# EAGLE design isolatedPowerSerial (EAGLE 6.4)
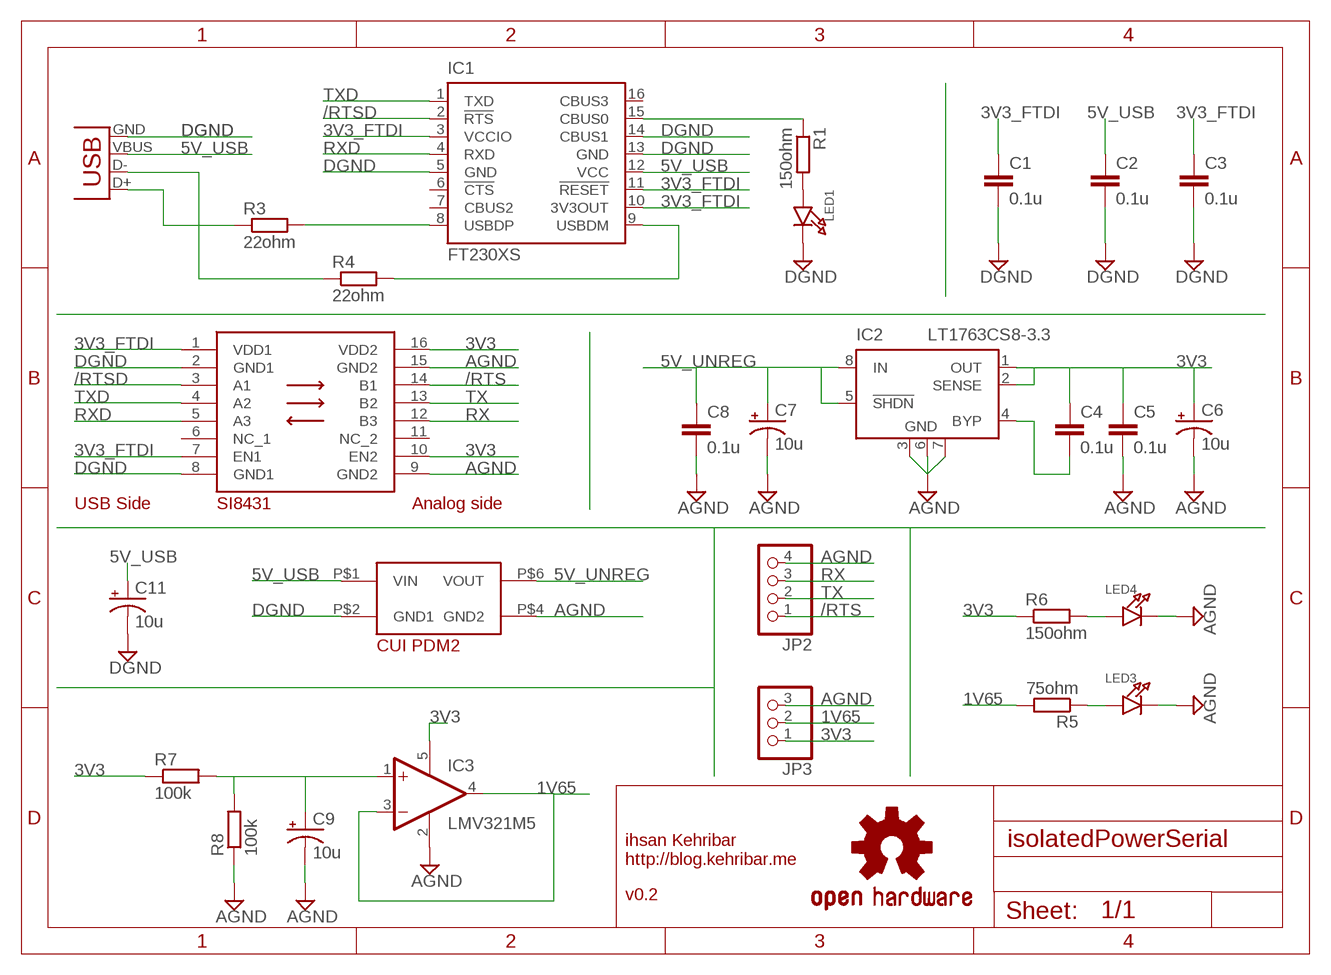
[diagram p0: schematic, sheet 1]

## Parts
C1  0.1u  C-EUC0805  [C0805]
C2  0.1u  C-EUC0805  [C0805]
C3  0.1u  C-EUC0805  [C0805]
C4  0.1u  C-EUC0805  [C0805]
C5  0.1u  C-EUC0805  [C0805]
C6  10u  CPOL-USB/3528-21R  [B/3528-21R]
C7  10u  CPOL-USB/3528-21R  [B/3528-21R]
C8  0.1u  C-EUC0805  [C0805]
C9  10u  CPOL-USB/3528-21R  [B/3528-21R]
C11  10u  CPOL-USB/3528-21R  [B/3528-21R]
IC1  FT230XS  [SSOP16]
IC2  LT1763CS8-3.3  [SOIC8]
IC3  LMV321M5  [SOT23-5]
JP1  USBSMD  [USB-MINIB]
JP2  HEADER-1X4ROUND  [1X04_ROUND]
JP3  HEADER-1X3ROUND  [1X03_ROUND]
LED1  LED0805  [CHIPLED_0805]
LED3  LED0805  [CHIPLED_0805]
LED4  LED0805  [CHIPLED_0805]
LOGO1  OSHW-LOGOS  [OSHW-LOGO-S]
R1  150ohm  R-EU_R0805  [R0805]
R3  22ohm  R-EU_R0805  [R0805]
R4  22ohm  R-EU_R0805  [R0805]
R5  75ohm  R-EU_R0805  [R0805]
R6  150ohm  R-EU_R0805  [R0805]
R7  100k  R-EU_R0805  [R0805]
R8  100k  R-EU_R0805  [R0805]
U$1  IHSAN_SI8431  [SO16L]
U$2  IHSAN_CUI_PDM2  [SIL7]

## Nets
1V65: IC3.3(-IN) IC3.4(OUT) JP3.2 R5.2
3V3: C4.1 C5.1 C6.+ IC2.1(OUT) IC2.2(SENSE) IC3.5(V+) JP3.1 R6.1 R7.1 U$1.10(EN2) U$1.16(VDD2)
3V3_FTDI: C1.1 C3.1 IC1.3(VCCIO) IC1.10(3V3OUT) IC1.11(!RESET) U$1.1(VDD1) U$1.7(EN1)
5V_UNREG: C7.+ C8.1 IC2.5(!SHDN) IC2.8(IN) U$2.P$6(VOUT)
5V_USB: C2.1 C11.+ IC1.12(VCC) JP1.VBUS U$2.P$1(VIN)
/RTS: JP2.1 U$1.14(B1)
/RTSD: IC1.2(!RTS) U$1.3(A1)
AGND: C5.2 C6.- C7.- C8.2 C9.- IC2.3(GND) IC2.6(GND) IC2.7(GND) IC3.2(V-) JP2.4 JP3.3 LED3.C LED4.C R8.1 U$1.9(GND2) U$1.15(GND2) U$2.P$4(GND2)
DGND: C1.2 C2.2 C3.2 C11.- IC1.5(GND) IC1.13(GND) IC1.14(CBUS1) JP1.GND LED1.C U$1.2(GND1) U$1.8(GND1) U$2.P$2(GND1)
N$1: IC1.15(CBUS0) R1.1
N$4: IC1.8(USBDP) R3.2
N$5: JP1.D+ R3.1
N$6: JP1.D- R4.1
N$7: IC1.9(USBDM) R4.2
N$8: C4.2 IC2.4(BYP)
N$9: LED3.A R5.1
N$10: LED4.A R6.2
N$12: LED1.A R1.2
N$14: C9.+ IC3.1(+IN) R7.2 R8.2
RX: JP2.3 U$1.12(B3)
RXD: IC1.4(RXD) U$1.5(A3)
TX: JP2.2 U$1.13(B2)
TXD: IC1.1(TXD) U$1.4(A2)
Unconnected: IC1.6(!CTS) IC1.7(CBUS2) IC1.16(CBUS3) U$1.6(NC_1) U$1.11(NC_2)

## Notes on the sheet
- USB Side | Analog side
- ihsan Kehribar
  http://blog.kehribar.me
- v0.2

## Library data of the parts
C1-C5 C8 = rcl:C-EU: CAPACITOR, European symbol
C6 C7 C9 C11 = rcl:CPOL-US: POLARIZED CAPACITOR, American symbol
IC1 = ftdichip:FT230X: USB to BASIC UART IC Auto generated by make-symbol-device-package-bsdl.ulp Rev. 43 Source: Data sheet <http://www.ftdichip.com/Support/Documents/DataSheets/ICs/DS_FT230X.pdf>
IC2 = linear-technology:LT1763CS8: 500mA, Low Noise, LDO Micropower Regulators Source: http://cds.linear.com/docs/Datasheet/1763ff.pdf; MPN: LT1763CS8-3.3; OC_FARNELL: 1273617; OC_NEWARK: 57M6055
IC3 = linear:LMV321?*: General Purpose, Low Voltage, Rail-to-Rail Output Operational Amplifiers Source: http://www.national.com/mpf/LM/LMV321.html http://www.national.com/dt/lmv_qual.pdf
JP1 = SparkFun-Connectors:USB: USB Connectors USB-B-PTH is fully proven SKU : PRT-00139/CONN-08278 USB-miniB is fully proven SKU : PRT-00587 USB-A-PCB is untested. USB-A-H is throughly reviewed, but untested. Spark Fun Electronics SKU : PRT-00437 USB-B-SMT is throughly reviewed, but untested. Needs silkscreen touching up. USB-A-S has not been used/tested USB-MB-H has not been used/tested USB-MICROB has been used. CONN-09505
JP2 = microbuilder:HEADER-1X4: PIN HEADER
JP3 = microbuilder:HEADER-1X3: PIN HEADER
LED1 LED3 LED4 = microbuilder:LED: LED 0603 - 0603 Surface Mount Package 2mA: Green LED - Low Power (3.9mcd, 2ma, 1.7Vf) - Digikey: 475-2709-2-ND Orange LED - Low Power (9.8mcd, 2ma, 1.8Vf) - Digikey: 475-1194-2-ND Red LED - Low Power (5mcd, 2ma, 1.8Vf) - Digikey: 475-1195-2-ND Yellow LED - Low Power (7mcd, 2ma, 1.8Vf) - Digikey: 475-1196-2-ND 5mA: Blue LED - Low Power (17mcd, 5ma, 2.9Vf) - Digikey: LNJ937W8CRACT-ND 0805 - 0805 Surface Mount Package 2mA: Red LED (8.8mcd, 2mA, 1.8Vf, Clear) - Low Power [Digikey: 475-2510-1-ND] Green LED (5mcd, 2mA, 1.8Vf, Clear) - Low Power [Digikey: 475-2730-1-ND] Yellow LED (11.3mcd, 2mA, 1.8Vf, Clear) - Low Power [Digikey: 475-2555-1-ND] 20mA: Red LED (104mcd, 20mA, Diffused) - LS R976 [Digikey: 475-1278-6-ND] Red LED (12mcd, 20mA, 2.0Vf, Clear) - APT2012EC [Digikey: 754-1128-1-ND] Green LED (15mcd, 20mA, 2.2Vf, Clear) - APT2012GC [Digikey: 754-1131-1-ND] Orange LED (160mcd, 20mA, 2.1Vf, Clear) - APT2012SECK [Digikey: 754-1130-1-ND] 1206 - 1206 Surface Mount Package Green LED (26mcd, 20mA, Diffused) - LG N971 [Digikey: 475-1407-6-ND] Red LED (15mcd, 20mA, Diffused) - LH N974 [Digikey: 475-1416-6-ND]
LOGO1 = SparkFun-Aesthetics:OSHW-LOGO: Open Source Hardware Logo This logo indicates the piece of hardware it is found on incorporates a OSHW license and/or adheres to the definition of open source hardware found here: http://freedomdefined.org/OSHW
R1 R3-R8 = rcl:R-EU_: RESISTOR, European symbol
U$1 = SparkFun-DigitalIC:IHSAN_SI8431
U$2 = SparkFun-DigitalIC:IHSAN_CUI_PDM2

## Board
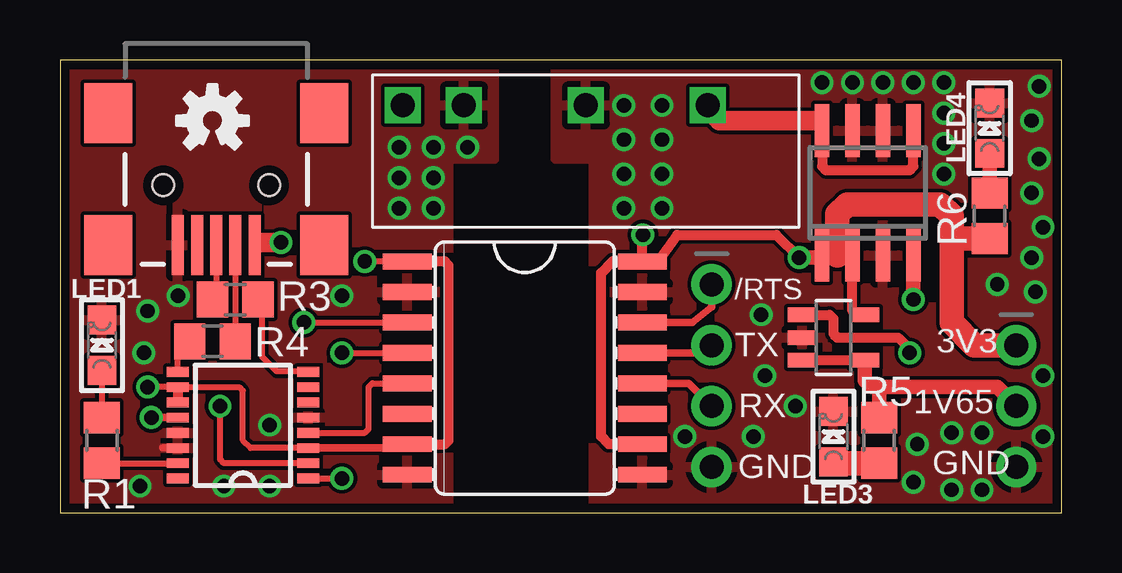
[diagram p1: board, top side]
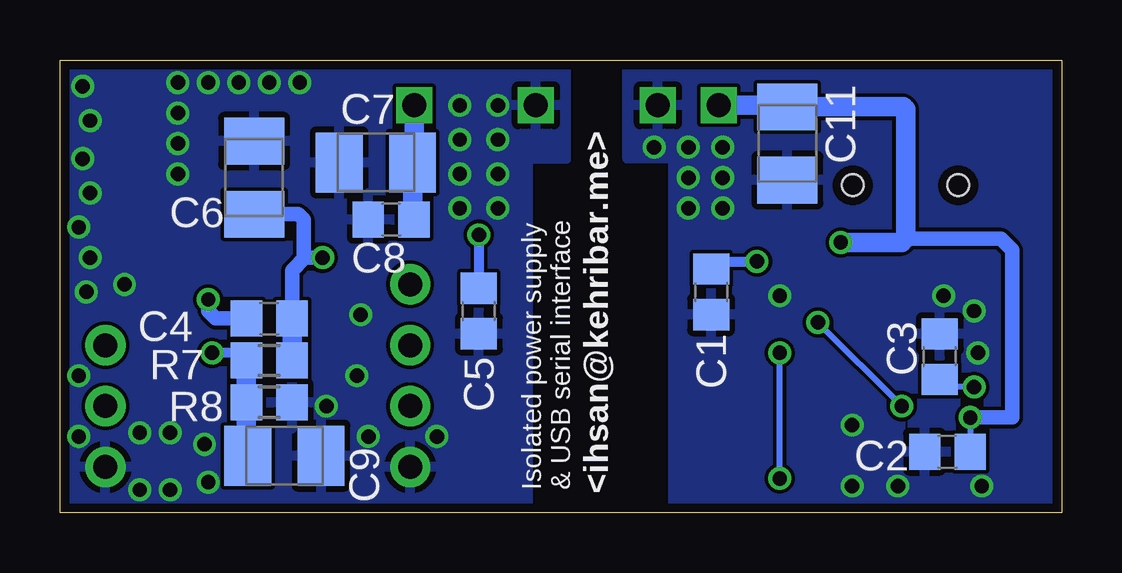
[diagram p2: board, bottom side, seen from below]

Size 41.74 x 18.88 mm. Coordinates in mm from the lower left corner, seen from the top.
Outline: 0,0 41.74,0 41.74,18.88 0,18.88 0,0
Copper layers (1*16): Top 0.0356mm / dielectric 1.5011mm / Bottom 0.0356mm
Design rules "LaenPCBOrder": minimum track width 6mil, minimum drill 13mil, track to track 6mil, track to pad 6mil, pad to pad 6mil, via to via 6mil, smd to smd 6mil, copper to edge 15mil, drill to drill 6mil, minimum pad ring 7mil, minimum via ring 7mil, stop-mask expansion 4mil, vias tented up to drill 0mil, thermal gap 10mil

### Footprints (pad centres in the part's own frame; a part is rotated, then mirrored left to right if it is on the bottom)
C0805 = smd 1.3 x 1.5: 1 -0.95,0; 2 0.95,0
B/3528-21R = smd 1.95 x 2.5: + 1.525,0; - -1.525,0
SSOP16 = smd 0.914 x 0.406: 1 -2.718,2.223; 2 -2.718,1.587; 3 -2.718,0.953; 4 -2.718,0.318; 5 -2.718,-0.318; 6 -2.718,-0.953; 7 -2.718,-1.587; 8 -2.718,-2.223; 9 2.718,-2.223; 10 2.718,-1.587; 11 2.718,-0.953; 12 2.718,-0.318; 13 2.718,0.318; 14 2.718,0.953; 15 2.718,1.587; 16 2.718,2.223
SOIC8 = smd 0.6 x 2.2: 1 -1.905,-2.6; 2 -0.635,-2.6; 3 0.635,-2.6; 4 1.905,-2.6; 5 1.905,2.6; 6 0.635,2.6; 7 -0.635,2.6; 8 -1.905,2.6
SOT23-5 = smd 0.6 x 1.2: 1 -0.95,-1.306; 2 0,-1.306; 3 0.95,-1.306; 4 0.95,1.306; 5 -0.95,1.306
USB-MINIB = smd 2.5 x 0.5: D+ 2.5,0; D- 2.5,0.8; GND 2.5,-1.6; ID 2.5,-0.8; VBUS 2.5,1.6 | smd 2.5 x 2: MTN1 -3,4.5; MTN2 2.5,4.5; MTN3 -3,-4.5; MTN4 2.5,-4.5 | hole 0.9: 0,2.2; 0,-2.2
1X04_ROUND = drill 1 pad 1.676: 1 -3.81,0; 2 -1.27,0; 3 1.27,0; 4 3.81,0
1X03_ROUND = drill 1 pad 1.676: 1 -2.54,0; 2 0,0; 3 2.54,0
CHIPLED_0805 = smd 1.2 x 1.2: A 0,-1.05; C 0,1.05
R0805 = smd 1.3 x 1.5: 1 -0.95,0; 2 0.95,0
SO16L = smd 0.66 x 2.032: 1 -4.445,-4.902; 2 -3.175,-4.902; 3 -1.905,-4.902; 4 -0.635,-4.902; 5 0.635,-4.902; 6 1.905,-4.902; 7 3.175,-4.902; 8 4.445,-4.902; 9 4.445,4.902; 10 3.175,4.902; 11 1.905,4.902; 12 0.635,4.902; 13 -0.635,4.902; 14 -1.905,4.902; 15 -3.175,4.902; 16 -4.445,4.902
SIL7 = drill 1 square: P$1 -7.62,0; P$2 -5.08,0; P$4 0,0; P$6 5.08,0

### Placement (x,y rotation side)
C1  14.61,9.21 270 bottom
C2  4.76,2.54 180 bottom
C3  5.08,6.51 90 bottom
C4  33.02,8.1 180 bottom
C5  24.29,8.41 270 bottom
C6  33.66,13.97 270 bottom
C7  28.57,14.61 0 bottom
C8  27.94,12.22 180 bottom
C9  32.38,2.38 180 bottom
C11  11.43,15.4 90 bottom
IC1  7.62,3.65 180 top
IC2  33.66,13.34 0 top
IC3  32.23,7.3 270 top
JP1  6.51,13.65 270 top
JP2  27.15,5.71 270 top
JP3  39.85,4.45 270 top
LED1  1.75,6.99 0 top
LED3  32.23,3.17 0 top
LED4  38.73,16.03 0 top
LOGO1  6.35,16.35 0 top
R1  1.75,3.02 90 top
R3  7.3,8.89 0 top
R4  6.35,7.14 180 top
R5  34.13,3.02 90 top
R6  38.73,12.38 90 top
R7  33.02,6.35 180 bottom
R8  33.02,4.6 180 bottom
U$1  19.37,6.03 270 top
U$2  21.91,16.99 0 top

### Tracks (layer width: path | path; a pad name or v marks a point on that pad's centre or on a via)
1V65
  Top 0.406: IC3.4 IC3.3
  Top 0.61: IC3.4 33.53,5.52 33.81,5.24 35.72,5.24 | 35.72,5.24 39.05,5.24 JP3.2 | R5.2 34.13,5.24 35.72,5.24
3V3  (via drill 0.6)
  Top 0.406: U$1.16 24.27,11.57 v24.29,11.59 | U$1.16 24.92,10.48 25.72,11.59 29.84,11.59 v30.8,10.64 | IC3.5 33.18,8.25 33.02,8.41 IC2.2 | U$1.10 22.86,2.86 22.54,3.17 22.54,10 23.02,10.48 U$1.16
  Top 0.61: IC2.2 32.38,10.73 IC2.1 31.65,10.64 v30.8,10.64 33.02,10.64
  Top 1.016: JP3.1 38.1,6.99 37.15,7.94 37.15,11.27 | 37.15,11.27 37.15,12.38 36.67,12.86 32.8,12.86 32.38,12.45 32.38,10.73 | R6.1 37.15,11.43 37.15,11.27
  Bottom 0.406: v24.29,11.59 C5.1
  Bottom 0.61: C4.1 32.07,10.1 31.53,10.64 v30.8,10.64 31.59,10.64 31.59,12.22 31.81,12.45 C6.+
  Bottom 0.813: C4.1 R7.1
  Bottom 1.016: 33.72,12.38 C6.+
3V3_FTDI  (via drill 0.6)
  Top 0.254: IC1.3 7.94,2.7 7.62,3.02 7.62,5.08 7.46,5.24 IC1.10 v3.65,5.24 | U$1.1 v12.7,10.48
  Top 0.305: IC1.3 13.65,2.7 | 13.81,2.86 13.65,2.7 | 13.65,2.7 U$1.7
  Top 0.406: IC1.10 IC1.11 | U$1.7 16.03,2.86 16.19,3.02 16.19,10.32 16.03,10.48 U$1.1
  Bottom 0.254: v3.65,5.24 3.81,5.24 5.08,5.24 C3.1 | 13.97,10.48 v12.7,10.48
  Bottom 0.406: C1.1 14.61,10.34 U$1.1 v12.7,10.48
5V_UNREG
  Top 0.406: 31.43,16.19 31.43,16.35 31.59,16.35 31.75,16.19 IC2.8 31.75,14.45 31.91,14.29 35.4,14.29 35.56,14.45 IC2.5
  Top 0.813: U$2.P$6 26.99,16.83 27.46,16.35 31.43,16.35
  Bottom 0.813: U$2.P$6 26.99,14.67 C7.+ 27.05,12.28 C8.1
5V_USB  (via drill 0.6)
  Top 0.254: JP1.VBUS 8.29,11.15 8.41,11.27
  Top 0.305: IC1.12 v3.81,3.97
  Top 0.813: 8.41,11.27 v9.21,11.27
  Bottom 0.254: v3.81,3.97 C2.1
  Bottom 0.61: v3.81,3.97 2.06,3.97 2.06,10.95 2.54,11.43 6.51,11.43
  Bottom 0.813: U$2.P$1 11.49,16.99 C11.+ 6.61,16.92 6.51,16.83 6.51,11.43 6.67,11.27 v9.21,11.27
/RTS
  Top 0.305: U$1.14 26.35,7.94 27.15,8.57 JP2.1
/RTSD  (via drill 0.6)
  Top 0.254: 8.57,2.06 IC1.2 6.83,2.06 6.67,2.22 v6.67,4.45 | v10.16,7.94 U$1.3
  Bottom 0.254: v6.67,4.45 v10.16,7.94
AGND  (via drill 0.6)
  other vias: 31.75,17.94 33.02,17.94 34.29,17.94 35.56,17.94 23.5,16.99 25.08,16.99 23.5,15.56 25.08,15.56 25.08,14.13 23.5,14.13 23.5,12.7 25.08,12.7 30.64,4.45 29.21,8.26 29.37,5.71 28.89,3.17 26.04,3.17 36.83,15.4 36.83,16.67 36.83,17.94 36.83,14.13 40.8,17.78 40.48,16.35 40.8,14.76 40.48,13.34 40.96,11.91 40.48,10.64 39.05,9.53 40.64,9.21 35.72,2.86 37.15,3.33 38.42,3.33 37.15,0.95 38.42,0.95 35.56,1.27 40.96,5.71 40.96,3.17
  pour Top: 41.75,18.89 20.64,18.89 20.64,14.76 22.23,14.76 22.23,0 41.75,0
  pour Bottom: 22.23,0 22.23,14.76 20.64,14.76 20.64,18.89 41.75,18.89 41.75,0
DGND  (via drill 0.6)
  Top 0.305: IC1.14 4.29,2.7
  other vias: 8.73,3.65 15.56,15.24 16.99,15.24 14.13,13.97 14.13,15.24 14.13,12.7 15.56,13.97 15.56,12.7 6.83,1.11 8.73,1.11 11.75,9.05 3.33,1.11 3.65,8.41 4.92,9.05 3.49,6.67
  pour Top: 0,18.89 0,0 16.19,0 16.19,14.76 18.1,14.76 18.1,18.89
  pour Bottom: 0,18.89 0,0 16.19,0 16.19,14.76 18.1,14.76 18.1,18.89
N$1
  Top 0.254: R1.1 IC1.15
N$4
  Top 0.254: IC1.8 10.32,5.89 9.03,5.89 8.41,6.51 8.41,8.26 8.25,8.42 R3.2
N$5
  Top 0.254: JP1.D+ 6.51,9.05 R3.1
N$6
  Top 0.254: JP1.D- 7.31,7.15 R4.1
N$7
  Top 0.254: IC1.9 4.9,6.65 R4.2
N$8  (via drill 0.6)
  Top 0.61: IC2.4 v35.56,8.89
  Bottom 0.61: v35.56,8.89 35.56,8.41 35.24,8.1 C4.2
N$9
  Top 1.016: R5.1 32.28,2.07 LED3.A
N$10
  Top 0.61: LED4.A R6.2
N$12
  Top 0.254: LED1.A R1.2
N$14  (via drill 0.6)
  Top 0.406: IC3.1 32.07,8.25 32.23,8.1 32.23,7.46 32.38,7.3 34.92,7.3 35.4,6.83 v35.4,6.67
  Bottom 0.406: R8.2 33.97,6.19 34.13,6.67 v35.4,6.67
  Bottom 0.813: R7.2 R8.2 33.97,2.44 C9.+
RX
  Top 0.305: U$1.12 26.19,5.4 JP2.3
RXD
  Top 0.254: U$1.5 13.02,5.4 12.86,5.24 12.86,3.49 12.7,3.33 IC1.4
TX
  Top 0.305: U$1.13 26.83,6.67 JP2.2
TXD  (via drill 0.6)
  Top 0.254: IC1.1 v11.75,1.43 | v11.75,6.67 U$1.4
  Bottom 0.254: v11.75,1.43 v11.75,6.67

### Text on the board
tPlace: /RTS | TX | 3V3 | RX | 1V65 | GND | GND
bNames: <ihsan@kehribar.me> | Isolated power supply / & USB serial interface